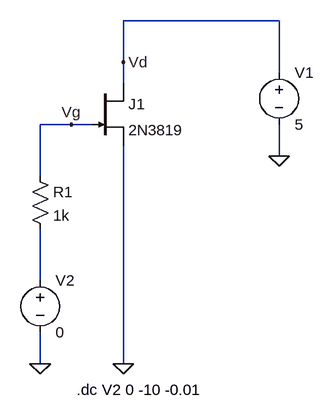
[diagram p0: schematic Transconductance.asc]
Transconductance.asc, the LTspice schematic file:
Version 4
SHEET 1 880 680
WIRE 480 32 240 32
WIRE 240 96 240 32
WIRE 480 112 480 32
WIRE 240 128 240 96
WIRE 160 192 112 192
WIRE 192 192 160 192
WIRE 480 240 480 192
WIRE 112 272 112 192
WIRE 112 432 112 352
WIRE 112 560 112 512
WIRE 240 560 240 224
FLAG 112 560 0
FLAG 480 240 0
FLAG 240 560 0
FLAG 160 192 Vg
FLAG 240 96 Vd
SYMBOL njf 192 128 R0
SYMATTR InstName J1
SYMATTR Value 2N3819
SYMBOL res 96 256 R0
SYMATTR InstName R1
SYMATTR Value 1k
SYMBOL voltage 480 96 R0
WINDOW 123 0 0 Left 0
WINDOW 39 0 0 Left 0
SYMATTR InstName V1
SYMATTR Value 5
SYMBOL voltage 112 416 R0
WINDOW 123 0 0 Left 0
WINDOW 39 0 0 Left 0
SYMATTR InstName V2
SYMATTR Value 0
TEXT 168 600 Left 2 !.dc V2 0 -10 -0.01

The netlist it stands for:
* Transconductance.asc
J1 Vd Vg 0 2N3819
R1 Vg N001 1k
V1 Vd 0 5
V2 N001 0 0
.model NJF NJF
.model PJF PJF
.lib standard.jft
.dc V2 0 -10 -0.01
.backanno
.end